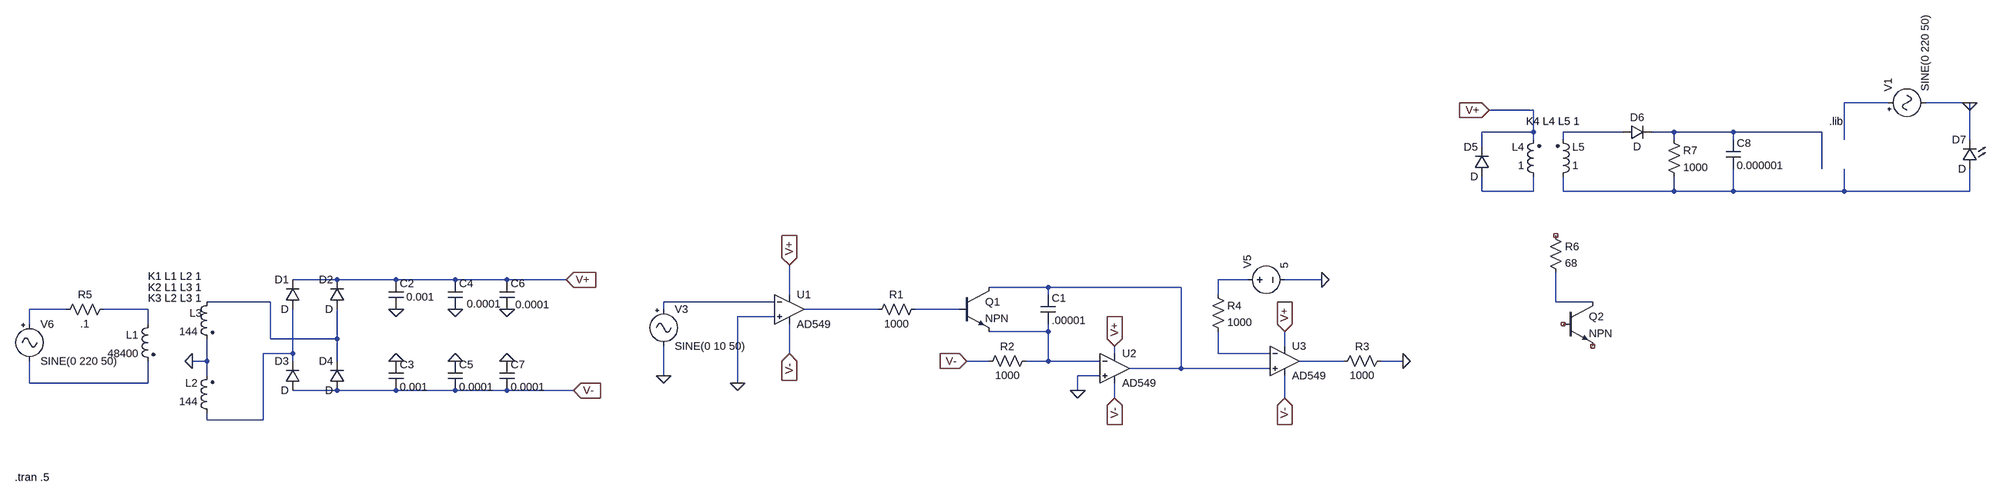
[diagram p0: schematic project 1 - analogue firing circuit.asc]
project 1 - analogue firing circuit.asc, the LTspice schematic file:
Version 4
SHEET 1 1828 680
WIRE 1632 -768 1536 -768
WIRE 1808 -768 1712 -768
WIRE 864 -752 768 -752
WIRE 864 -704 864 -752
WIRE 864 -704 752 -704
WIRE 1056 -704 928 -704
WIRE 1168 -704 1120 -704
WIRE 1296 -704 1168 -704
WIRE 1488 -704 1296 -704
WIRE 864 -688 864 -704
WIRE 928 -688 928 -704
WIRE 1168 -688 1168 -704
WIRE 1296 -688 1296 -704
WIRE 1536 -688 1536 -768
WIRE 1808 -688 1808 -768
WIRE 752 -672 752 -704
WIRE 1488 -624 1488 -704
WIRE 752 -576 752 -608
WIRE 864 -576 864 -608
WIRE 864 -576 752 -576
WIRE 928 -576 928 -608
WIRE 1168 -576 1168 -608
WIRE 1168 -576 928 -576
WIRE 1296 -576 1296 -624
WIRE 1296 -576 1168 -576
WIRE 1536 -576 1536 -624
WIRE 1536 -576 1296 -576
WIRE 1808 -576 1808 -624
WIRE 1808 -576 1536 -576
WIRE -1984 -384 -2080 -384
WIRE -1856 -384 -1984 -384
WIRE -1728 -384 -1856 -384
WIRE -1616 -384 -1728 -384
WIRE -1488 -384 -1616 -384
WIRE 32 -384 -32 -384
WIRE 192 -384 112 -384
WIRE -400 -368 -528 -368
WIRE -112 -368 -400 -368
WIRE -960 -352 -960 -416
WIRE -400 -352 -400 -368
WIRE -32 -352 -32 -384
WIRE -2128 -336 -2272 -336
WIRE -992 -336 -1232 -336
WIRE 912 -336 912 -400
WIRE 992 -336 912 -336
WIRE -2576 -320 -2656 -320
WIRE -2400 -320 -2496 -320
WIRE -1232 -320 -1232 -336
WIRE -768 -320 -928 -320
WIRE -592 -320 -688 -320
WIRE -992 -304 -1072 -304
WIRE -2656 -288 -2656 -320
WIRE -2400 -288 -2400 -320
WIRE -400 -272 -400 -288
WIRE -400 -272 -528 -272
WIRE -2128 -256 -2128 -336
WIRE -1984 -256 -1984 -320
WIRE -1984 -256 -2128 -256
WIRE 112 -240 112 -272
WIRE -2080 -224 -2080 -320
WIRE -2080 -224 -2144 -224
WIRE -960 -224 -960 -288
WIRE -256 -224 -256 -240
WIRE -32 -224 -32 -272
WIRE 80 -224 -32 -224
WIRE -2272 -208 -2272 -256
WIRE -2272 -208 -2304 -208
WIRE -2080 -208 -2080 -224
WIRE -1984 -208 -1984 -256
WIRE -528 -208 -576 -208
WIRE -400 -208 -400 -272
WIRE -400 -208 -448 -208
WIRE -288 -208 -400 -208
WIRE 240 -208 144 -208
WIRE 368 -208 320 -208
WIRE -112 -192 -112 -368
WIRE -112 -192 -224 -192
WIRE 80 -192 -112 -192
WIRE -2272 -176 -2272 -208
WIRE -1232 -176 -1232 -240
WIRE -288 -176 -336 -176
WIRE -2656 -160 -2656 -208
WIRE -2400 -160 -2400 -208
WIRE -2400 -160 -2656 -160
WIRE -1072 -160 -1072 -304
WIRE -1984 -144 -2080 -144
WIRE -1856 -144 -1984 -144
WIRE -1728 -144 -1856 -144
WIRE -1616 -144 -1728 -144
WIRE -1472 -144 -1616 -144
WIRE -336 -144 -336 -176
WIRE -256 -128 -256 -160
WIRE 112 -128 112 -176
WIRE -2272 -80 -2272 -96
WIRE -2144 -80 -2144 -224
WIRE -2144 -80 -2272 -80
FLAG -1072 -160 0
FLAG -1488 -384 V+
IOPIN -1488 -384 In
FLAG -1472 -144 V-
IOPIN -1472 -144 In
FLAG -1232 -176 0
FLAG -960 -416 V+
IOPIN -960 -416 In
FLAG -960 -224 V-
IOPIN -960 -224 In
FLAG -256 -240 V+
IOPIN -256 -240 In
FLAG -256 -128 V-
IOPIN -256 -128 In
FLAG -336 -144 0
FLAG 112 -272 V+
IOPIN 112 -272 In
FLAG 112 -128 V-
IOPIN 112 -128 In
FLAG 192 -384 0
FLAG -576 -208 V-
IOPIN -576 -208 In
FLAG -2304 -208 0
FLAG -1856 -320 0
FLAG -1728 -320 0
FLAG -1616 -320 0
FLAG -1616 -208 0
FLAG -1728 -208 0
FLAG -1856 -208 0
FLAG 368 -208 0
FLAG 768 -752 V+
IOPIN 768 -752 In
FLAG 1808 -768 0
SYMBOL OpAmps\\AD549 -960 -384 R0
SYMATTR InstName U1
SYMBOL OpAmps\\AD549 -256 -256 R0
SYMATTR InstName U2
SYMBOL OpAmps\\AD549 112 -272 R0
SYMATTR InstName U3
SYMBOL res -672 -336 R90
WINDOW 0 0 56 VBottom 2
WINDOW 3 32 56 VTop 2
SYMATTR InstName R1
SYMATTR Value 1000
SYMBOL cap -416 -352 R0
SYMATTR InstName C1
SYMATTR Value .00001
SYMBOL Misc\\signal -1232 -336 R0
WINDOW 123 0 0 Left 0
WINDOW 39 0 0 Left 0
SYMATTR InstName V3
SYMATTR Value SINE(0 10 50)
SYMBOL npn -592 -368 R0
SYMATTR InstName Q1
SYMBOL res -432 -224 R90
WINDOW 0 0 56 VBottom 2
WINDOW 3 32 56 VTop 2
SYMATTR InstName R2
SYMATTR Value 1000
SYMBOL res 224 -192 R270
WINDOW 0 32 56 VTop 2
WINDOW 3 0 56 VBottom 2
SYMATTR InstName R3
SYMATTR Value 1000
SYMATTR SpiceLine tol=1 pwr=0.1
SYMBOL res -48 -368 R0
SYMATTR InstName R4
SYMATTR Value 1000
SYMBOL voltage 16 -384 R270
WINDOW 123 0 0 Left 0
WINDOW 39 0 0 Left 0
SYMATTR InstName V5
SYMATTR Value 5
SYMBOL ind2 -2384 -304 M0
SYMATTR InstName L1
SYMATTR Value 48400
SYMATTR Type ind
SYMBOL ind2 -2256 -80 R180
WINDOW 0 36 80 Left 2
WINDOW 3 36 40 Left 2
SYMATTR InstName L2
SYMATTR Value 144
SYMATTR Type ind
SYMBOL ind2 -2256 -352 M0
WINDOW 0 27 40 Left 2
SYMATTR InstName L3
SYMATTR Value 144
SYMATTR Type ind
SYMBOL diode -2064 -320 R180
WINDOW 0 24 64 Left 2
WINDOW 3 24 0 Left 2
SYMATTR InstName D1
SYMBOL diode -1968 -320 R180
WINDOW 0 24 64 Left 2
WINDOW 3 24 0 Left 2
SYMATTR InstName D2
SYMBOL diode -2064 -144 R180
WINDOW 0 24 64 Left 2
WINDOW 3 24 0 Left 2
SYMATTR InstName D3
SYMBOL diode -1968 -144 R180
WINDOW 0 24 64 Left 2
WINDOW 3 24 0 Left 2
SYMATTR InstName D4
SYMBOL cap -1872 -384 R0
WINDOW 3 38 37 Left 2
SYMATTR Value 0.001
SYMATTR InstName C2
SYMBOL cap -1872 -208 R0
SYMATTR InstName C3
SYMATTR Value 0.001
SYMBOL cap -1744 -384 R0
WINDOW 3 41 52 Left 2
SYMATTR Value 0.0001
SYMATTR InstName C4
SYMBOL cap -1744 -208 R0
SYMATTR InstName C5
SYMATTR Value 0.0001
SYMBOL cap -1632 -384 R0
WINDOW 3 34 54 Left 2
SYMATTR Value 0.0001
SYMATTR InstName C6
SYMBOL cap -1632 -208 R0
SYMATTR InstName C7
SYMATTR Value 0.0001
SYMBOL Misc\\signal -2656 -304 R0
WINDOW 123 0 0 Left 0
WINDOW 39 0 0 Left 0
SYMATTR InstName V6
SYMATTR Value SINE(0 220 50)
SYMBOL res -2480 -336 R90
WINDOW 0 0 56 VBottom 2
WINDOW 3 32 56 VTop 2
SYMATTR InstName R5
SYMATTR Value .1
SYMBOL npn 928 -336 R0
SYMATTR InstName Q2
SYMBOL res 896 -496 R0
SYMATTR InstName R6
SYMATTR Value 68
SYMBOL ind2 880 -592 R180
WINDOW 0 36 80 Left 2
WINDOW 3 36 40 Left 2
SYMATTR InstName L4
SYMATTR Value 1
SYMATTR Type ind
SYMBOL ind2 912 -592 M180
WINDOW 0 36 80 Left 2
WINDOW 3 36 40 Left 2
SYMATTR InstName L5
SYMATTR Value 1
SYMATTR Type ind
SYMBOL diode 768 -608 R180
WINDOW 0 24 64 Left 2
WINDOW 3 24 0 Left 2
SYMATTR InstName D5
SYMBOL diode 1056 -688 R270
WINDOW 0 32 32 VTop 2
WINDOW 3 0 32 VBottom 2
SYMATTR InstName D6
SYMBOL cap 1280 -688 R0
SYMATTR InstName C8
SYMATTR Value 0.000001
SYMBOL res 1152 -704 R0
SYMATTR InstName R7
SYMATTR Value 1000
SYMBOL Misc\\signal 1616 -768 R270
WINDOW 123 0 0 Left 0
WINDOW 39 0 0 Left 0
SYMATTR InstName V1
SYMATTR Value SINE(0 220 50)
SYMBOL LED 1824 -624 R180
WINDOW 0 24 64 Left 2
WINDOW 3 24 0 Left 2
SYMATTR InstName D7
TEXT -2400 -392 Left 2 !K1 L1 L2 1
TEXT -2400 -368 Left 2 !K2 L1 L3 1
TEXT -2400 -344 Left 2 !K3 L2 L3 1
TEXT 848 -728 Left 2 !K4 L4 L5 1
TEXT 1504 -728 Left 2 !.lib
TEXT -2688 104 Left 2 !.tran .5

The netlist it stands for:
* project 1 - analogue firing circuit.asc
XU1 0 N009 V+ V- N013 AD549  ; pins In+ In- V+ V- OUT
XU2 0 N015 V+ V- N007 AD549  ; pins In+ In- V+ V- OUT
XU3 N007 N017 V+ V- N018 AD549  ; pins In+ In- V+ V- OUT
R1 N014 N013 1000
C1 N007 N015 .00001
V3 N009 0 SINE(0 10 50)
Q1 N007 N014 N015 0 NPN
R2 N015 V- 1000
R3 N018 0 1000 tol=1 pwr=0.1
R4 N006 N017 1000
V5 N006 0 5
L1 N012 N019 48400
L2 N016 0 144
L3 N008 0 144
D1 N016 V+ D
D2 N008 V+ D
D3 V- N016 D
D4 V- N008 D
C2 V+ 0 0.001
C3 0 V- 0.001
C4 V+ 0 0.0001
C5 0 V- 0.0001
C6 V+ 0 0.0001
C7 0 V- 0.0001
V6 N011 N019 SINE(0 220 50)
R5 N012 N011 .1
Q2 N010 NC_01 NC_02 0 NPN
R6 NC_03 N010 68
L4 N004 V+ 1
L5 N005 N002 1
D5 N004 V+ D
D6 N002 N003 D
C8 N003 N005 0.000001
R7 N003 N005 1000
V1 N001 0 SINE(0 220 50)
D7 N005 0 D
.model D D
.lib standard.dio
.model NPN NPN
.model PNP PNP
.lib standard.bjt
K1 L1 L2 1
K2 L1 L3 1
K3 L2 L3 1
K4 L4 L5 1
.lib
.tran .5
.backanno
.end